# Altium schematic sheet Main Board.SchDoc
size A3
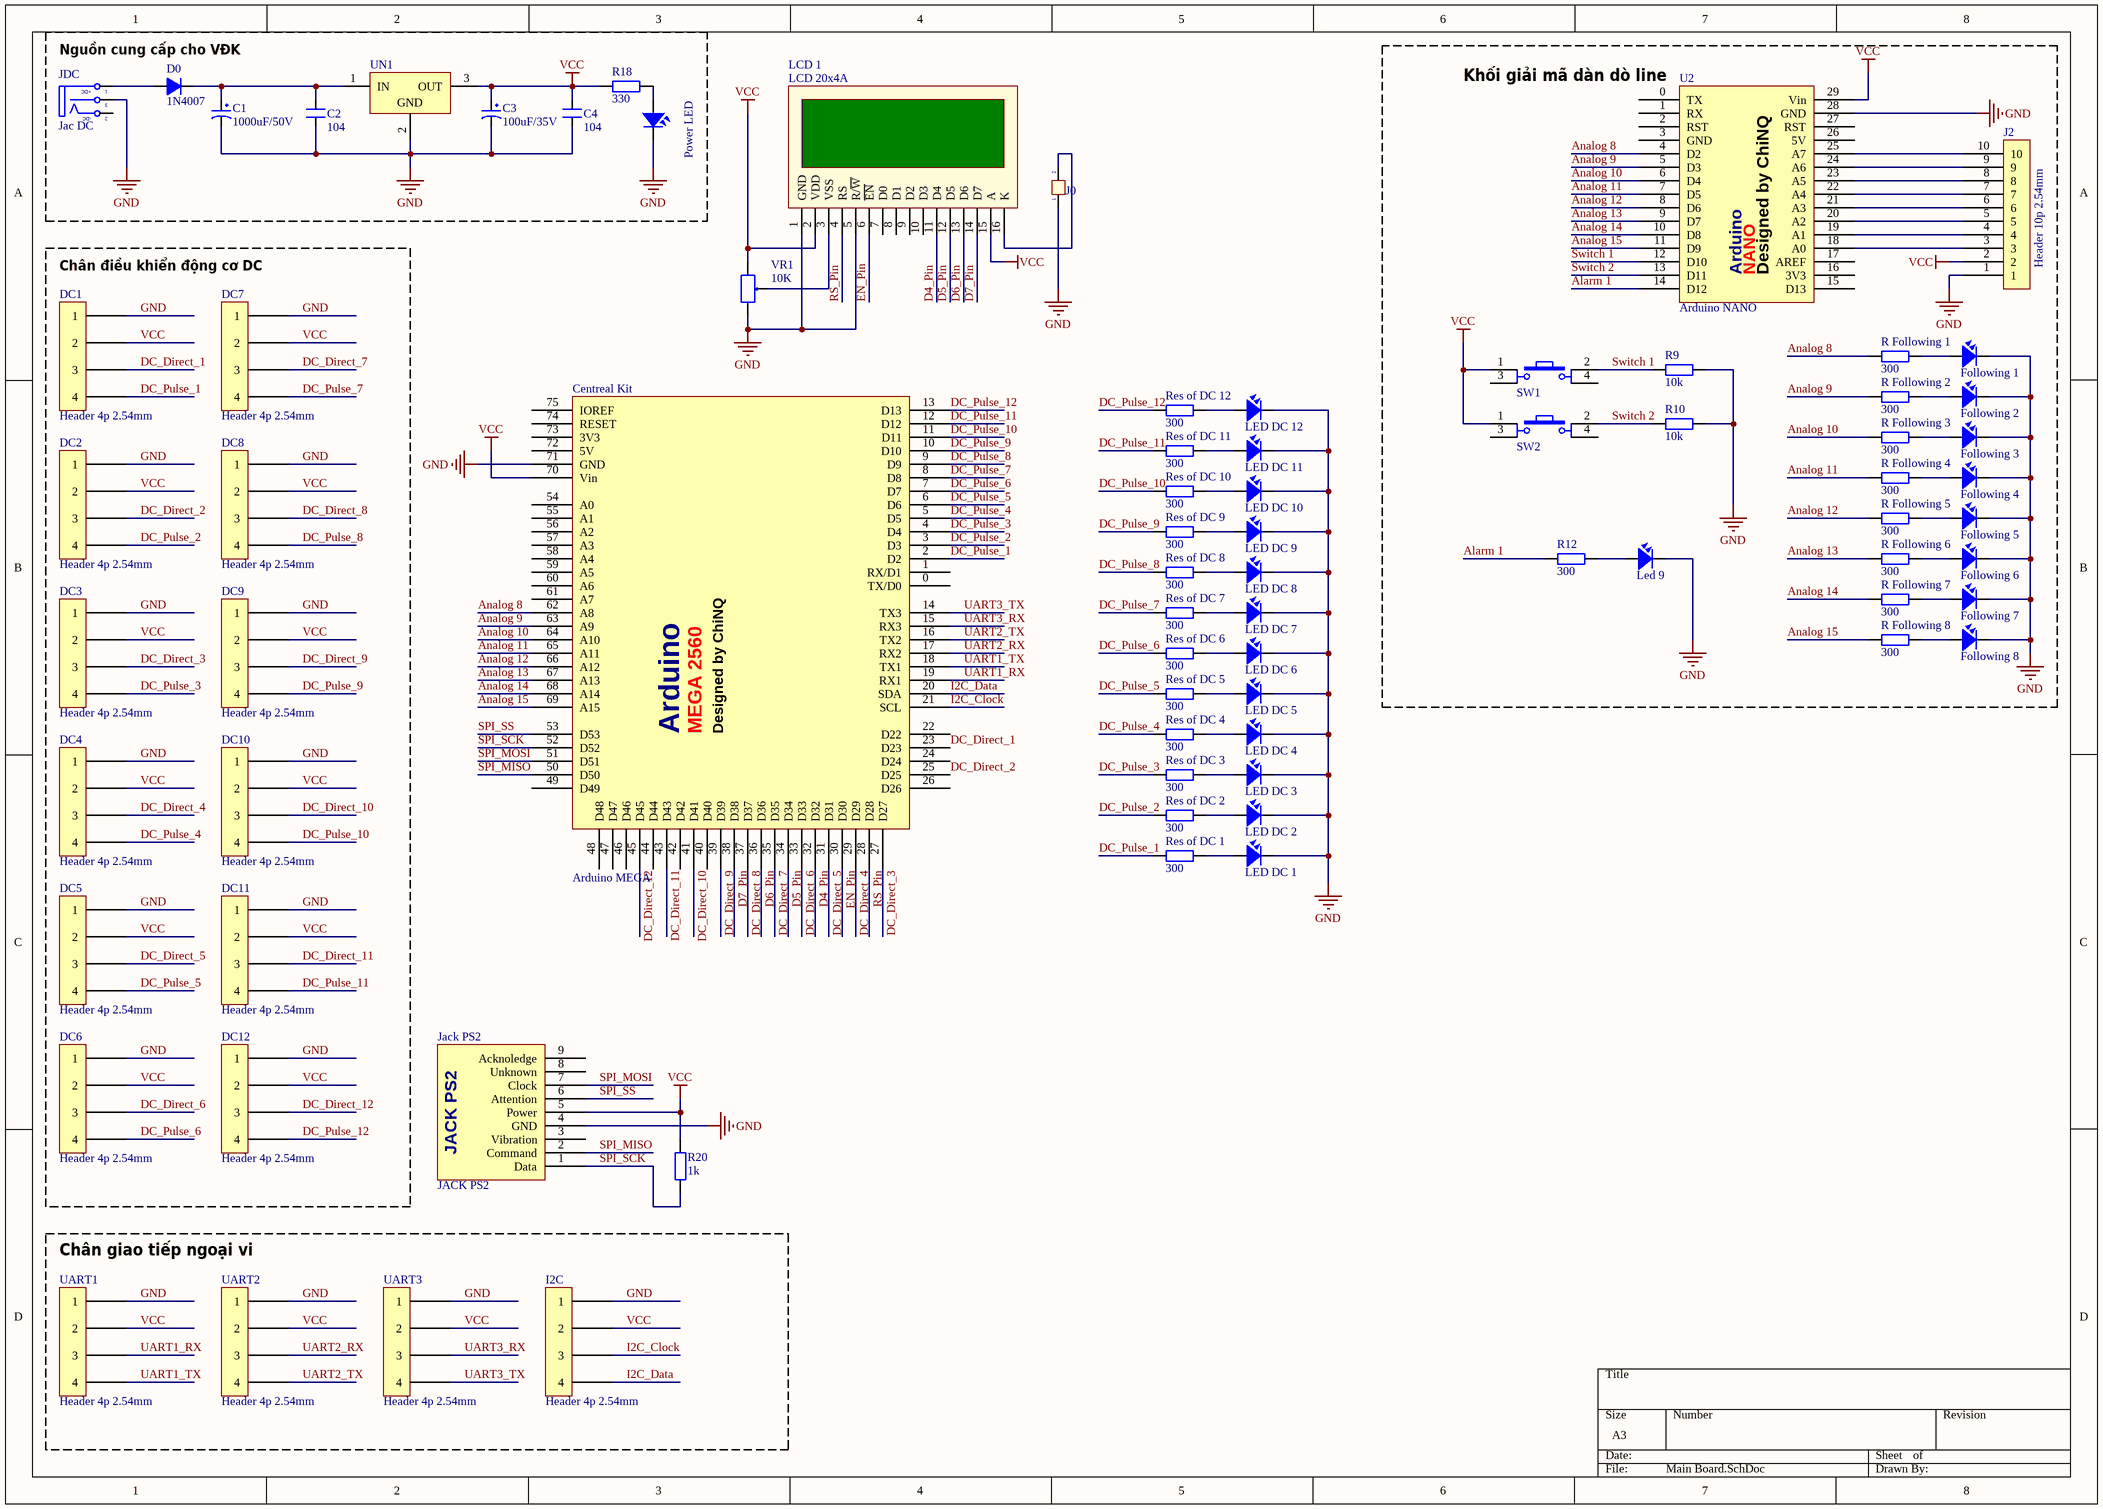
[diagram p0: Main Board.SchDoc]

## Parts
C1  1000uF/50V  [CP1.5/3.4]
C2  104  [CN2]
C3  100uF/35V  [CP1.5/3.4]
C4  104  [CN2]
Centreal_Kit  Arduino MEGA  [Arduino MEGA 2560 (Flipped)]
D0  1N4007  [D1A]
DC1  Header 4p 2.54mm  [Header 4p 2.54mm]
DC2  Header 4p 2.54mm  [Header 4p 2.54mm]
DC3  Header 4p 2.54mm  [Header 4p 2.54mm]
DC4  Header 4p 2.54mm  [Header 4p 2.54mm]
DC5  Header 4p 2.54mm  [Header 4p 2.54mm]
DC6  Header 4p 2.54mm  [Header 4p 2.54mm]
DC7  Header 4p 2.54mm  [Header 4p 2.54mm]
DC8  Header 4p 2.54mm  [Header 4p 2.54mm]
DC9  Header 4p 2.54mm  [Header 4p 2.54mm]
DC10  Header 4p 2.54mm  [Header 4p 2.54mm]
DC11  Header 4p 2.54mm  [Header 4p 2.54mm]
DC12  Header 4p 2.54mm  [Header 4p 2.54mm]
Following_1  LED  [LED-3]  (value not drawn)
Following_2  LED  [LED-3]  (value not drawn)
Following_3  LED  [LED-3]  (value not drawn)
Following_4  LED  [LED-3]  (value not drawn)
Following_5  LED  [LED-3]  (value not drawn)
Following_6  LED  [LED-3]  (value not drawn)
Following_7  LED  [LED-3]  (value not drawn)
Following_8  LED  [LED-3]  (value not drawn)
I2C  Header 4p 2.54mm  [Header 4p 2.54mm]
J0  Jumper 2  [jp2h]  (value not drawn)
J2  Header 10p 2.54mm  [Header 10p 2.54mm]
Jack_PS2  JACK PS2  [Jack PS2]
JDC  Jac DC  [DC-IN]
LCD_1  LCD 20x4A  [LCD20X4A]
Led_9  LED  [LED-3]  (value not drawn)
LED_DC_1  LED  [LED-3]  (value not drawn)
LED_DC_2  LED  [LED-3]  (value not drawn)
LED_DC_3  LED  [LED-3]  (value not drawn)
LED_DC_4  LED  [LED-3]  (value not drawn)
LED_DC_5  LED  [LED-3]  (value not drawn)
LED_DC_6  LED  [LED-3]  (value not drawn)
LED_DC_7  LED  [LED-3]  (value not drawn)
LED_DC_8  LED  [LED-3]  (value not drawn)
LED_DC_9  LED  [LED-3]  (value not drawn)
LED_DC_10  LED  [LED-3]  (value not drawn)
LED_DC_11  LED  [LED-3]  (value not drawn)
LED_DC_12  LED  [LED-3]  (value not drawn)
Power_LED  LED  [LED-3]  (value not drawn)
R9  10k  [R1/4W]
R10  10k  [R1/4W]
R12  300  [R1/4W]
R18  330  [R1/4W]
R20  1k  [R1/4W]
R_Following_1  300  [R1/4W]
R_Following_2  300  [R1/4W]
R_Following_3  300  [R1/4W]
R_Following_4  300  [R1/4W]
R_Following_5  300  [R1/4W]
R_Following_6  300  [R1/4W]
R_Following_7  300  [R1/4W]
R_Following_8  300  [R1/4W]
Res_of_DC_1  300  [R1/4W]
Res_of_DC_2  300  [R1/4W]
Res_of_DC_3  300  [R1/4W]
Res_of_DC_4  300  [R1/4W]
Res_of_DC_5  300  [R1/4W]
Res_of_DC_6  300  [R1/4W]
Res_of_DC_7  300  [R1/4W]
Res_of_DC_8  300  [R1/4W]
Res_of_DC_9  300  [R1/4W]
Res_of_DC_10  300  [R1/4W]
Res_of_DC_11  300  [R1/4W]
Res_of_DC_12  300  [R1/4W]
SW1  SW  [SW4]  (value not drawn)
SW2  SW  [SW4]  (value not drawn)
U2  Arduino NANO  [Arduino NANO]
UART1  Header 4p 2.54mm  [Header 4p 2.54mm]
UART2  Header 4p 2.54mm  [Header 4p 2.54mm]
UART3  Header 4p 2.54mm  [Header 4p 2.54mm]
UN1  L78M05CP  [QTO-220H2]  (value not drawn)
VR1  10K  [VR]

## Blocks framed on the sheet
Nguồn cung cấp cho VĐK: C1-C4 D0 JDC Power_LED R18 UN1
Khối giải mã dàn dò line: Following_1-Following_8 J2 Led_9 R9 R10 R12 R_Following_1-R_Following_8 SW1 SW2 U2
Chân điều khiển động cơ DC: DC1-DC12
Chân giao tiếp ngoại vi: I2C UART1-UART3

## Nets
GND: C1.2 C2.2 C3.2 C4.1 Centreal_Kit.71(GND) DC1.1 DC2.1 DC3.1 DC4.1 DC5.1 DC6.1 DC7.1 DC8.1 DC9.1 DC10.1 DC11.1 DC12.1 Following_1.2 Following_2.2 Following_3.2 Following_4.2 Following_5.2 Following_6.2 Following_7.2 Following_8.2 I2C.1 J0.1 J2.1 Jack_PS2.4(GND) JDC.3(S) LCD_1.1(GND) LCD_1.5(R/~{W}) Led_9.2 LED_DC_1.2 LED_DC_2.2 LED_DC_3.2 LED_DC_4.2 LED_DC_5.2 LED_DC_6.2 LED_DC_7.2 LED_DC_8.2 LED_DC_9.2 LED_DC_10.2 LED_DC_11.2 LED_DC_12.2 Power_LED.2 R9.2 R10.2 U2.28(GND) UART1.1 UART2.1 UART3.1 UN1.2(GND) VR1.3
VCC: C3.1 C4.2 Centreal_Kit.70(Vin) DC1.2 DC2.2 DC3.2 DC4.2 DC5.2 DC6.2 DC7.2 DC8.2 DC9.2 DC10.2 DC11.2 DC12.2 I2C.2 J2.2 Jack_PS2.5(Power) LCD_1.2(VDD) LCD_1.15(A) R18.2 R20.1 SW1.1 SW2.1 U2.29(Vin) UART1.2 UART2.2 UART3.2 UN1.3(OUT) VR1.1
Alarm 1: R12.1 U2.14(D12)
Analog 8: Centreal_Kit.62(A8) R_Following_1.1 U2.4(D2)
Analog 9: Centreal_Kit.63(A9) R_Following_2.1 U2.5(D3)
Analog 10: Centreal_Kit.64(A10) R_Following_3.1 U2.6(D4)
Analog 11: Centreal_Kit.65(A11) R_Following_4.1 U2.7(D5)
Analog 12: Centreal_Kit.66(A12) R_Following_5.1 U2.8(D6)
Analog 13: Centreal_Kit.67(A13) R_Following_6.1 U2.9(D7)
Analog 14: Centreal_Kit.68(A14) R_Following_7.1 U2.10(D8)
Analog 15: Centreal_Kit.69(A15) R_Following_8.1 U2.11(D9)
D4_Pin: Centreal_Kit.32(D32) LCD_1.11(D4)
D5_Pin: Centreal_Kit.34(D34) LCD_1.12(D5)
D6_Pin: Centreal_Kit.36(D36) LCD_1.13(D6)
D7_Pin: Centreal_Kit.38(D38) LCD_1.14(D7)
DC_Direct_1: Centreal_Kit.23(D23) DC1.3
DC_Direct_2: Centreal_Kit.25(D25) DC2.3
DC_Direct_3: Centreal_Kit.27(D27) DC3.3
DC_Direct_4: Centreal_Kit.29(D29) DC4.3
DC_Direct_5: Centreal_Kit.31(D31) DC5.3
DC_Direct_6: Centreal_Kit.33(D33) DC6.3
DC_Direct_7: Centreal_Kit.35(D35) DC7.3
DC_Direct_8: Centreal_Kit.37(D37) DC8.3
DC_Direct_9: Centreal_Kit.39(D39) DC9.3
DC_Direct_10: Centreal_Kit.41(D41) DC10.3
DC_Direct_11: Centreal_Kit.43(D43) DC11.3
DC_Direct_12: Centreal_Kit.45(D45) DC12.3
DC_Pulse_1: Centreal_Kit.2(D2) DC1.4 Res_of_DC_1.2
DC_Pulse_2: Centreal_Kit.3(D3) DC2.4 Res_of_DC_2.2
DC_Pulse_3: Centreal_Kit.4(D4) DC3.4 Res_of_DC_3.2
DC_Pulse_4: Centreal_Kit.5(D5) DC4.4 Res_of_DC_4.2
DC_Pulse_5: Centreal_Kit.6(D6) DC5.4 Res_of_DC_5.2
DC_Pulse_6: Centreal_Kit.7(D7) DC6.4 Res_of_DC_6.2
DC_Pulse_7: Centreal_Kit.8(D8) DC7.4 Res_of_DC_7.2
DC_Pulse_8: Centreal_Kit.9(D9) DC8.4 Res_of_DC_8.2
DC_Pulse_9: Centreal_Kit.10(D10) DC9.4 Res_of_DC_9.2
DC_Pulse_10: Centreal_Kit.11(D11) DC10.4 Res_of_DC_10.2
DC_Pulse_11: Centreal_Kit.12(D12) DC11.4 Res_of_DC_11.2
DC_Pulse_12: Centreal_Kit.13(D13) DC12.4 Res_of_DC_12.2
EN_Pin: Centreal_Kit.30(D30) LCD_1.6(~{EN})
I2C_Clock: Centreal_Kit.21(SCL) I2C.3
I2C_Data: Centreal_Kit.20(SDA) I2C.4
RS_Pin: Centreal_Kit.28(D28) LCD_1.4(RS)
SPI_MISO: Centreal_Kit.50(D50) Jack_PS2.2(Command)
SPI_MOSI: Centreal_Kit.51(D51) Jack_PS2.7(Clock)
SPI_SCK: Centreal_Kit.52(D52) Jack_PS2.1(Data) R20.2
SPI_SS: Centreal_Kit.53(D53) Jack_PS2.6(Attention)
Switch 1: R9.1 SW1.2 U2.12(D10)
Switch 2: R10.1 SW2.2 U2.13(D11)
UART1_RX: Centreal_Kit.19(RX1) UART1.3
UART1_TX: Centreal_Kit.18(TX1) UART1.4
UART2_RX: Centreal_Kit.17(RX2) UART2.3
UART2_TX: Centreal_Kit.16(TX2) UART2.4
UART3_RX: Centreal_Kit.15(RX3) UART3.3
UART3_TX: Centreal_Kit.14(TX3) UART3.4
NetC1_1: C1.1 C2.1 D0.2(K) UN1.1(IN)
NetD0_1: D0.1(A) JDC.1(T)
NetFollowing_1_1: Following_1.1 R_Following_1.2
NetFollowing_2_1: Following_2.1 R_Following_2.2
NetFollowing_3_1: Following_3.1 R_Following_3.2
NetFollowing_4_1: Following_4.1 R_Following_4.2
NetFollowing_5_1: Following_5.1 R_Following_5.2
NetFollowing_6_1: Following_6.1 R_Following_6.2
NetFollowing_7_1: Following_7.1 R_Following_7.2
NetFollowing_8_1: Following_8.1 R_Following_8.2
NetJ0_2: J0.2 LCD_1.16(K)
NetJ2_3: J2.3 U2.18(A0)
NetJ2_4: J2.4 U2.19(A1)
NetJ2_5: J2.5 U2.20(A2)
NetJ2_6: J2.6 U2.21(A3)
NetJ2_7: J2.7 U2.22(A4)
NetJ2_8: J2.8 U2.23(A5)
NetJ2_9: J2.9 U2.24(A6)
NetJ2_10: J2.10 U2.25(A7)
NetLCD_1_3: LCD_1.3(VSS) VR1.2
NetLed_9_1: Led_9.1 R12.2
NetLED_DC_1_1: LED_DC_1.1 Res_of_DC_1.1
NetLED_DC_2_1: LED_DC_2.1 Res_of_DC_2.1
NetLED_DC_3_1: LED_DC_3.1 Res_of_DC_3.1
NetLED_DC_4_1: LED_DC_4.1 Res_of_DC_4.1
NetLED_DC_5_1: LED_DC_5.1 Res_of_DC_5.1
NetLED_DC_6_1: LED_DC_6.1 Res_of_DC_6.1
NetLED_DC_7_1: LED_DC_7.1 Res_of_DC_7.1
NetLED_DC_8_1: LED_DC_8.1 Res_of_DC_8.1
NetLED_DC_9_1: LED_DC_9.1 Res_of_DC_9.1
NetLED_DC_10_1: LED_DC_10.1 Res_of_DC_10.1
NetLED_DC_11_1: LED_DC_11.1 Res_of_DC_11.1
NetLED_DC_12_1: LED_DC_12.1 Res_of_DC_12.1
NetPower_LED_1: Power_LED.1 R18.1

Not connected (* = marked no-connect by the designer): Centreal_Kit 0(TX/D0) 1(RX/D1) 22(D22) 24(D24) 26(D26) 40(D40) 42(D42) 44(D44) 46(D46) 47(D47) 48(D48) 49(D49) 54(A0) 55(A1) 56(A2) 57(A3) 58(A4) 59(A5) 60(A6) 61(A7) 72(5V) 73(3V3) 74(RESET) 75(IOREF); Jack_PS2 3(Vibration) 8(Unknown) 9(Acknoledge); JDC 2(TN); LCD_1 7(D0) 8(D1) 9(D2) 10(D3); SW1 3 4; SW2 3 4; U2 0(TX) 1(RX) 2(RST) 3(GND) 15(D13) 16(3V3) 17(AREF) 26(5V) 27(RST)

## Notes on the sheet
- (in symbol Arduino MEGA 2560) Arduino; MEGA 2560; Designed by ChiNQ
- (in symbol Arduino NANO) Arduino; NANO; Designed by ChiNQ
- (in symbol DCIN) +DC; -DC

## Library data of the parts
C1 = CP4: Cap 1000uF/16V - 220uF/50V; Description 5: 4,7uF>10uF/250V_3,3uF>10uF/400V - 2,2uF>4,7uF/450V; Description 1: 2200uF-3300uF/6,3V - 1000uF-2200uF/10V; Description 2: 1000uF/16V - 470uF => 1000uF/25V - 100uF/100V; Description 3: 330uF>470uF/35V_220uF>470uF/50V_10uF>22uF/250V; Description 4: 220uF => 330uF/63V - 10uF =>33uF/160 - 200V; Value: 1000uF/16V
C2 C4 = CN2: Cap np 104 => 105pF; Value: 0.1uF
C3 = CP3: Cap 100uF/35V - 470uF/16V; Value: 100uF/35V/50V; Description 1: 1000uF/6,3V - 470uF/16V - 330uF - 25V; Description 2: 220uF/35V - 100uF/50V - 63V - 4,7uF/200V; Description 3: 22uF => 33uF100V - 3,3uF => 4,7uF/250V; Description 4: 2,2uF =>3,3uF/350 - 2,2uF/400V - 1uF/450V
Centreal_Kit = Arduino MEGA 2560
D0 = D1A: Diode 1A; Value: 1N4007
Following_1-Following_8 Led_9 LED_DC_1-LED_DC_12 Power_LED = LED: LED Single colour Green and Red; Value: LED 3 ly Single Colour
J0 = JP 2: Value: JP 2
JDC = DCIN: Jac DC input; Value: Jac DC
LCD_1 = LCD20x4A: LCD dipslay 20 char, 4 line; Value: Jum 40; Value: LCD 20x4A
R9 R10 R12 R18 R20 R_Following_1-R_Following_8 Res_of_DC_1-Res_of_DC_12 = R1/4W: Resistor 1/4W; Value: R1/4W - 1K
SW1 SW2 = SW4: Switch button 4 pin; Value: Button chip 4 pin
UN1 = L78M05CP: Positive Voltage Regulator; Note: Tab is connected to pin 3 (GND).; Published: 24-Aug-2001; LatestRevisionDate: 17-Jul-2002; LatestRevisionNote: Re-released for DXP Platform.; DatasheetVersion: Apr-1994; PackageVersion: Jul-1998; PackageReference: ISOWATT220AB; Publisher: Altium Limited; PackageDescription: TO, Thru-Hole, Vertical, Heatsink Mounted; 3 In-Line Leads; Pitch 2.54 mm; Pin sequence 1, 3, 2; ComponentLink1Description: Manufacturer Link; ComponentLink1URL: http://www.st.com/; ComponentLink2Description: Datasheet; ComponentLink2URL: http://www.st.com/stonline/products/literature/ds/2146/l78m05c.pdf
VR1 = VR: Var Resistor; Value: VR 10K